# EAGLE schematic PediLEDStrip (EAGLE 7.1.0)
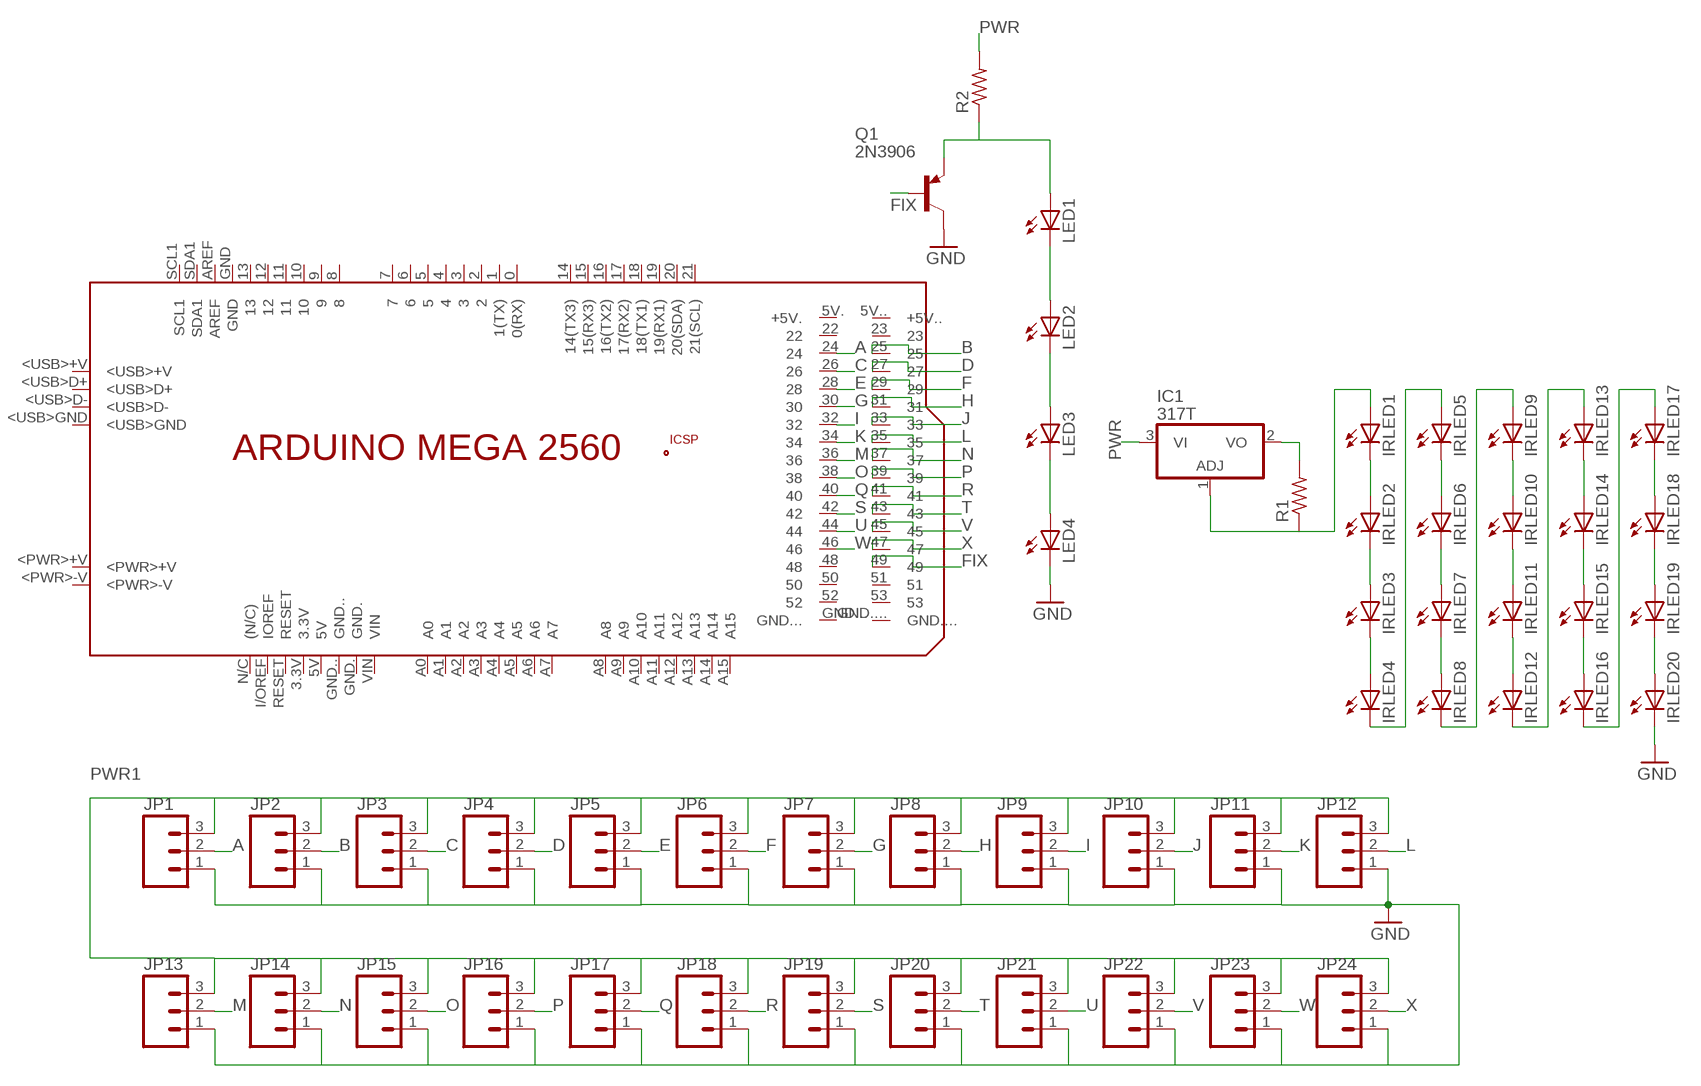
[diagram p0: schematic, sheet 1]

## Parts
IC1  317T  [TO220H]
IRLED1  LED5MM  [LED5MM]
IRLED2  LED5MM  [LED5MM]
IRLED3  LED5MM  [LED5MM]
IRLED4  LED5MM  [LED5MM]
IRLED5  LED5MM  [LED5MM]
IRLED6  LED5MM  [LED5MM]
IRLED7  LED5MM  [LED5MM]
IRLED8  LED5MM  [LED5MM]
IRLED9  LED5MM  [LED5MM]
IRLED10  LED5MM  [LED5MM]
IRLED11  LED5MM  [LED5MM]
IRLED12  LED5MM  [LED5MM]
IRLED13  LED5MM  [LED5MM]
IRLED14  LED5MM  [LED5MM]
IRLED15  LED5MM  [LED5MM]
IRLED16  LED5MM  [LED5MM]
IRLED17  LED5MM  [LED5MM]
IRLED18  LED5MM  [LED5MM]
IRLED19  LED5MM  [LED5MM]
IRLED20  LED5MM  [LED5MM]
JP1  M03PTH  [1X03]
JP2  M03PTH  [1X03]
JP3  M03PTH  [1X03]
JP4  M03PTH  [1X03]
JP5  M03PTH  [1X03]
JP6  M03PTH  [1X03]
JP7  M03PTH  [1X03]
JP8  M03PTH  [1X03]
JP9  M03PTH  [1X03]
JP10  M03PTH  [1X03]
JP11  M03PTH  [1X03]
JP12  M03PTH  [1X03]
JP13  M03PTH  [1X03]
JP14  M03PTH  [1X03]
JP15  M03PTH  [1X03]
JP16  M03PTH  [1X03]
JP17  M03PTH  [1X03]
JP18  M03PTH  [1X03]
JP19  M03PTH  [1X03]
JP20  M03PTH  [1X03]
JP21  M03PTH  [1X03]
JP22  M03PTH  [1X03]
JP23  M03PTH  [1X03]
JP24  M03PTH  [1X03]
LED1  LED5MM  [LED5MM]
LED2  LED5MM  [LED5MM]
LED3  LED5MM  [LED5MM]
LED4  LED5MM  [LED5MM]
PCB1  ARDUINO_MEGA2560  [ARDUINO_MEGA2560]
Q1  2N3906  [TO92]
R1  R-US_0207/10  [0207/10]
R2  R-US_0207/10  [0207/10]

## Nets
A: JP1.2 PCB1.24
B: JP2.2 PCB1.25
C: JP3.2 PCB1.26
D: JP4.2 PCB1.27
E: JP5.2 PCB1.28
F: JP6.2 PCB1.29
FIX: PCB1.49 Q1.2(B)
G: JP7.2 PCB1.30
GND: IRLED20.K(C) JP1.1 JP2.1 JP3.1 JP4.1 JP5.1 JP6.1 JP7.1 JP8.1 JP9.1 JP10.1 JP11.1 JP12.1 JP13.1 JP14.1 JP15.1 JP16.1 JP17.1 JP18.1 JP19.1 JP20.1 JP21.1 JP22.1 JP23.1 JP24.1 LED4.K(C) Q1.1(C)
H: JP8.2 PCB1.31
I: JP9.2 PCB1.32
J: JP10.2 PCB1.33
K: JP11.2 PCB1.34
L: JP12.2 PCB1.35
M: JP13.2 PCB1.36
N: JP14.2 PCB1.37
N$1: LED1.K(C) LED2.A
N$2: LED2.K(C) LED3.A
N$3: LED3.K(C) LED4.A
N$4: LED1.A Q1.3(E) R2.1
N$29: IRLED1.K(C) IRLED2.A
N$30: IRLED2.K(C) IRLED3.A
N$31: IRLED3.K(C) IRLED4.A
N$32: IRLED4.K(C) IRLED5.A
N$33: IRLED5.K(C) IRLED6.A
N$34: IRLED6.K(C) IRLED7.A
N$35: IRLED7.K(C) IRLED8.A
N$36: IRLED8.K(C) IRLED9.A
N$37: IRLED9.K(C) IRLED10.A
N$38: IRLED10.K(C) IRLED11.A
N$39: IRLED11.K(C) IRLED12.A
N$40: IRLED12.K(C) IRLED13.A
N$41: IRLED13.K(C) IRLED14.A
N$42: IRLED15.K(C) IRLED16.A
N$43: IRLED14.K(C) IRLED15.A
N$44: IRLED16.K(C) IRLED17.A
N$45: IRLED17.K(C) IRLED18.A
N$46: IRLED18.K(C) IRLED19.A
N$47: IRLED19.K(C) IRLED20.A
N$48: IC1.2(VO) R1.2
N$49: IC1.1(ADJ) IRLED1.A R1.1
O: JP15.2 PCB1.38
P: JP16.2 PCB1.39
PWR: IC1.3(VI) R2.2
PWR1: JP1.3 JP2.3 JP3.3 JP4.3 JP5.3 JP6.3 JP7.3 JP8.3 JP9.3 JP10.3 JP11.3 JP12.3 JP13.3 JP14.3 JP15.3 JP16.3 JP17.3 JP18.3 JP19.3 JP20.3 JP21.3 JP22.3 JP23.3 JP24.3
Q: JP17.2 PCB1.40
R: JP18.2 PCB1.41
S: JP19.2 PCB1.42
T: JP20.2 PCB1.43
U: JP21.2 PCB1.44
V: JP22.2 PCB1.45
W: JP23.2 PCB1.46
X: JP24.2 PCB1.47
Unconnected: PCB1.0(0(RX)) PCB1.1(1(TX)) PCB1.2 PCB1.3 PCB1.3.3V PCB1.4 PCB1.5 PCB1.5V PCB1.5V.(+5V.) PCB1.5V..(+5V..) PCB1.6 PCB1.7 PCB1.8 PCB1.9 PCB1.10 PCB1.11 PCB1.12 PCB1.13 PCB1.14(14(TX3)) PCB1.15(15(RX3)) PCB1.16(16(TX2)) PCB1.17(17(RX2)) PCB1.18(18(TX1)) PCB1.19(19(RX1)) PCB1.20(20(SDA)) PCB1.21(21(SCL)) PCB1.22 PCB1.23 PCB1.48 PCB1.50 PCB1.51 PCB1.52 PCB1.53 PCB1.+5V_ PCB1.<PWR>+V PCB1.<PWR>-V PCB1.<USB>+V PCB1.<USB>D+ PCB1.<USB>D- PCB1.<USB>GND PCB1.A0 PCB1.A1 PCB1.A2 PCB1.A3 PCB1.A4 PCB1.A5 PCB1.A6 PCB1.A7 PCB1.A8 PCB1.A9 PCB1.A10 PCB1.A11 PCB1.A12 PCB1.A13 PCB1.A14 PCB1.A15 PCB1.AREF PCB1.GND PCB1.GND. PCB1.GND.. PCB1.GND... PCB1.GND.... PCB1.GND__ PCB1.I/OREF(IOREF) PCB1.MISO PCB1.MOSI PCB1.N/C((N/C)) PCB1.RESET PCB1.RESET. PCB1.SCK PCB1.SCL1 PCB1.SDA1 PCB1.VIN

## Library data of the parts
IC1 = linear:*317: Positive VOLTAGE REGULATOR
IRLED1-IRLED20 LED1-LED4 = adafruit:LED: LED OSRAM: - CHIPLED LG R971, LG N971, LY N971, LG Q971, LY Q971, LO R971, LY R971 LH N974, LH R974 LS Q976, LO Q976, LY Q976 LO Q996 - Hyper CHIPLED LW Q18S LB Q993, LB Q99A, LB R99A - SideLED LS A670, LO A670, LY A670, LG A670, LP A670 LB A673, LV A673, LT A673, LW A673 LH A674 LY A675 LS A676, LA A676, LO A676, LY A676, LW A676 LS A679, LY A679, LG A679 - Hyper Micro SIDELED® LS Y876, LA Y876, LO Y876, LY Y876 LT Y87S - SmartLED LW L88C, LW L88S LB L89C, LB L89S, LG L890 LS L89K, LO L89K, LY L89K LS L896, LA L896, LO L896, LY L896 - TOPLED LS T670, LO T670, LY T670, LG T670, LP T670 LSG T670, LSP T670, LSY T670, LOP T670, LYG T670 LG T671, LOG T671, LSG T671 LB T673, LV T673, LT T673, LW T673 LH T674 LS T676, LA T676, LO T676, LY T676, LB T676, LH T676, LSB T676, LW T676 LB T67C, LV T67C, LT T67C, LS T67K, LO T67K, LY T67K, LW E67C LS E67B, LA E67B, LO E67B, LY E67B, LB E67C, LV E67C, LT E67C LW T67C LS T679, LY T679, LG T679 LS T770, LO T770, LY T770, LG T770, LP T770 LB T773, LV T773, LT T773, LW T773 LH T774 LS E675, LA E675, LY E675, LS T675 LS T776, LA T776, LO T776, LY T776, LB T776 LHGB T686 LT T68C, LB T68C - Hyper Mini TOPLED® LB M676 - Mini TOPLED Santana® LG M470 LS M47K, LO M47K, LY M47K Source: http://www.osram.convergy.de/
JP1-JP24 = SparkFun-Connectors:M03: Header 3 Standard 3-pin 0.1" header. Use with straight break away headers (SKU : PRT-00116), right angle break away headers (PRT-00553), swiss pins (PRT-00743), machine pins (PRT-00117), and female headers (PRT-00115). Molex polarized connector foot print use with SKU : PRT-08232 with associated crimp pins and housings.
PCB1 = E14_Arduino_revB:ARDUINO_MEGA2560: Device for representing an Arduino Mega 2560 board with a footprint in an EAGLE design. Created by Dave Young for Element14. More EAGLE documentation at: http://www.element14.com/community/community/knode/cadsoft_eagle
Q1 = transistor-pnp:2N3906: PNP Transistor
R1 R2 = adafruit:R-US_: RESISTOR, American symbol

## Net classes
0 default: clearance 0.356 mm